# EAGLE schematic NCV7702B (EAGLE 5.06)
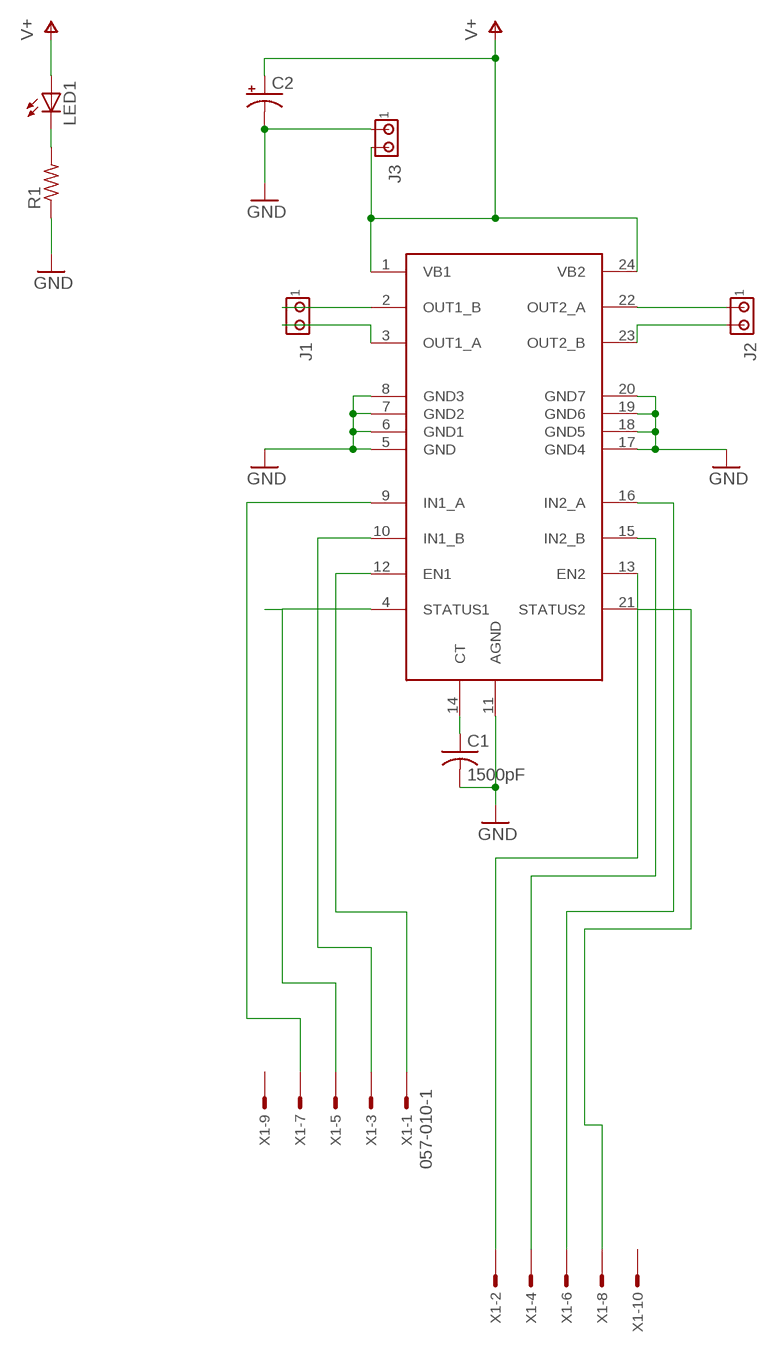
[diagram p0: schematic, sheet 1]

## Parts
C1  1500pF  C-US025-025X050  [C025-025X050]
C2  CPOL-USE5-10.5  [E5-10,5]
IC1  7702  [SO24W]
J1  MTA02-156  [1X2MTA]
J2  MTA02-156  [1X2MTA]
J3  MTA02-156  [1X2MTA]
LED1  LEDSMT1206  [1206]
R1  R-US_M1206  [M1206]
X1  057-010-1  [057-010-1]

## Nets
GND: C1.2 C2.- IC1.5(GND) IC1.6(GND1) IC1.7(GND2) IC1.8(GND3) IC1.11(AGND) IC1.17(GND4) IC1.18(GND5) IC1.19(GND6) IC1.20(GND7) J3.1 R1.1
N$1: IC1.2(OUT1_B) J1.1
N$2: IC1.10(IN1_B) X1.3
N$3: IC1.9(IN1_A) X1.7
N$4: IC1.13(EN2) X1.2
N$5: IC1.15(IN2_B) X1.4
N$6: IC1.3(OUT1_A) J1.2
N$7: IC1.22(OUT2_A) J2.1
N$8: IC1.23(OUT2_B) J2.2
N$9: IC1.16(IN2_A) X1.6
N$10: LED1.C R1.2
N$11: IC1.12(EN1) X1.1
N$15: IC1.21(STATUS2) X1.8
N$16: IC1.4(STATUS1) X1.5
N$17: C1.1 IC1.14(CT)
V+: C2.+ IC1.1(VB1) IC1.24(VB2) J3.2 LED1.A
Unconnected: X1.9 X1.10

## Library data of the parts
C1 = rcl:C-US: CAPACITOR, American symbol
C2 = rcl:CPOL-US: POLARIZED CAPACITOR, American symbol
IC1 = A-JD:7702
J1-J3 = con-amp:MTA02-156: AMP connector
LED1 = led:LED: LED OSRAM: - CHIPLED LG R971, LG N971, LY N971, LG Q971, LY Q971, LO R971, LY R971 LH N974, LH R974 LS Q976, LO Q976, LY Q976 LO Q996 - Hyper CHIPLED LW Q18S LB Q993, LB Q99A, LB R99A - SideLED LS A670, LO A670, LY A670, LG A670, LP A670 LB A673, LV A673, LT A673, LW A673 LH A674 LY A675 LS A676, LA A676, LO A676, LY A676, LW A676 LS A679, LY A679, LG A679 - Hyper Micro SIDELED® LS Y876, LA Y876, LO Y876, LY Y876 LT Y87S - SmartLED LW L88C, LW L88S LB L89C, LB L89S, LG L890 LS L89K, LO L89K, LY L89K LS L896, LA L896, LO L896, LY L896 - TOPLED LS T670, LO T670, LY T670, LG T670, LP T670 LSG T670, LSP T670, LSY T670, LOP T670, LYG T670 LG T671, LOG T671, LSG T671 LB T673, LV T673, LT T673, LW T673 LH T674 LS T676, LA T676, LO T676, LY T676, LB T676, LH T676, LSB T676, LW T676 LB T67C, LV T67C, LT T67C, LS T67K, LO T67K, LY T67K, LW E67C LS E67B, LA E67B, LO E67B, LY E67B, LB E67C, LV E67C, LT E67C LW T67C LS T679, LY T679, LG T679 LS T770, LO T770, LY T770, LG T770, LP T770 LB T773, LV T773, LT T773, LW T773 LH T774 LS E675, LA E675, LY E675, LS T675 LS T776, LA T776, LO T776, LY T776, LB T776 LHGB T686 LT T68C, LB T68C - Hyper Mini TOPLED® LB M676 - Mini TOPLED Santana® LG M470 LS M47K, LO M47K, LY M47K Source: http://www.osram.convergy.de LUXEON: - LUMILED® LXK2-PW12-R00, LXK2-PW12-S00, LXK2-PW14-U00, LXK2-PW14-V00 LXK2-PM12-R00, LXK2-PM12-S00, LXK2-PM14-U00 LXK2-PE12-Q00, LXK2-PE12-R00, LXK2-PE12-S00, LXK2-PE14-T00, LXK2-PE14-U00 LXK2-PB12-K00, LXK2-PB12-L00, LXK2-PB12-M00, LXK2-PB14-N00, LXK2-PB14-P00, LXK2-PB14-Q00 LXK2-PR12-L00, LXK2-PR12-M00, LXK2-PR14-Q00, LXK2-PR14-R00 LXK2-PD12-Q00, LXK2-PD12-R00, LXK2-PD12-S00 LXK2-PH12-R00, LXK2-PH12-S00 LXK2-PL12-P00, LXK2-PL12-Q00, LXK2-PL12-R00 Source: www.luxeon.com KINGBRIGHT: KA-3528ASYC Source: www.kingbright.com
R1 = resistor:R-US_: RESISTOR, American symbol
X1 = con-panduit:057-010-: CONNECTOR 10-pin series 057 contact pc board low profile headers